# EAGLE design jelly_encoder_Board (EAGLE 8.7.1)
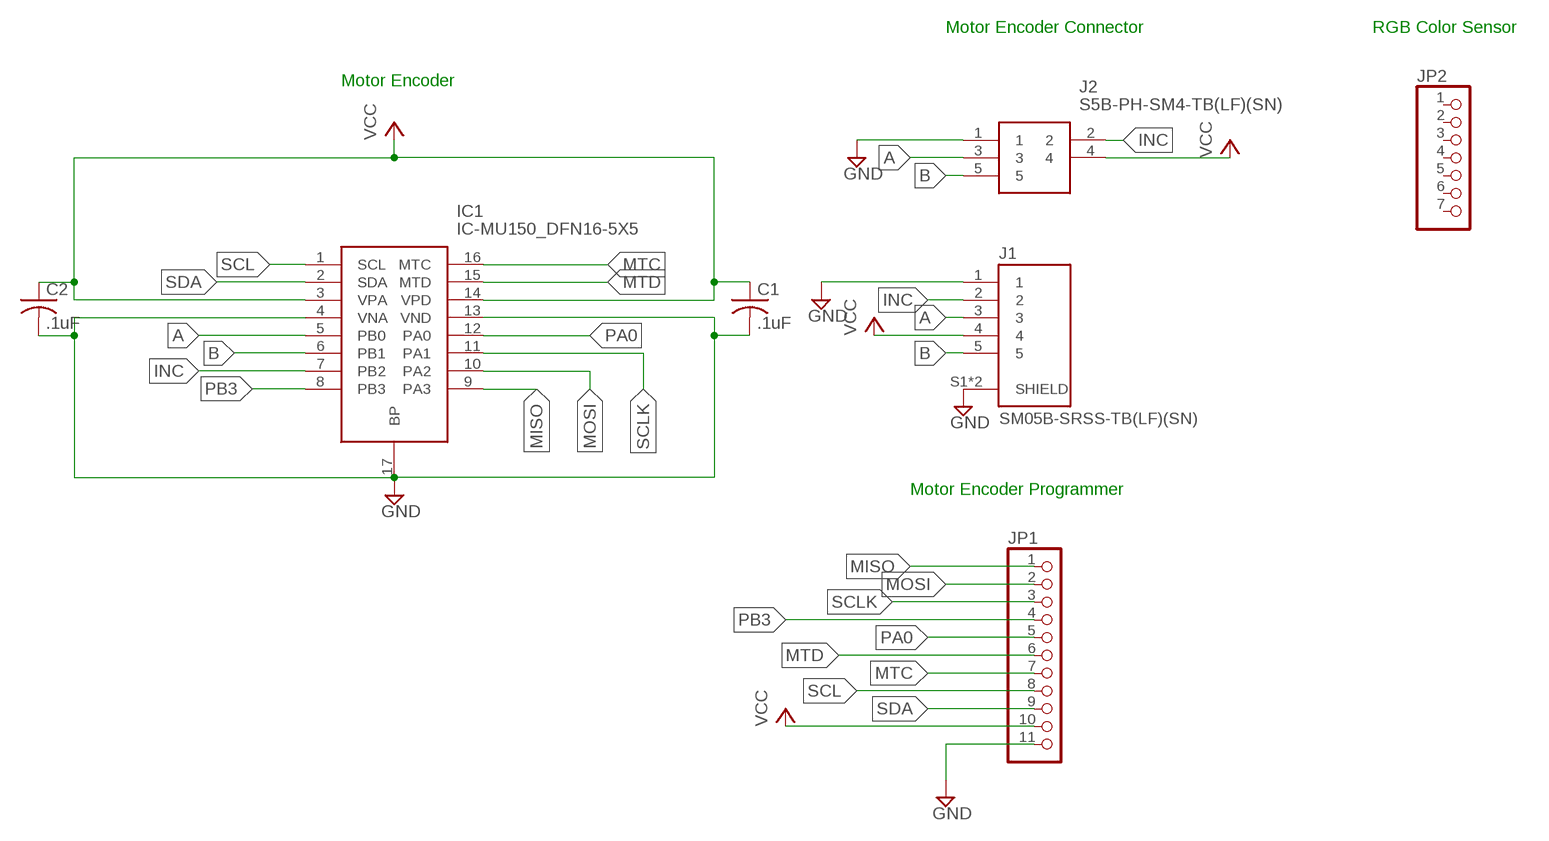
[diagram p0: schematic, sheet 1]

## Parts
C1  .1uF  C-USC0603  [C0603]
C2  .1uF  C-USC0603  [C0603]
IC1  IC-MU150_DFN16-5X5  [SON50P500X500X100-17N]
J1  SM05B-SRSS-TB(LF)(SN)  [JST_SM05B-SRSS-TB(LF)(SN)]
J2  S5B-PH-SM4-TB(LF)(SN)  [S5B-PH-SM4-TB_1]
JP1  PINHD-1X11/90  [1X11/90]
JP2  PINHD-1X7/90  [1X07/90]

## Nets
A: IC1.5(PB0) J1.3 J2.3
B: IC1.6(PB1) J1.5 J2.5
GND: C1.2 C2.2 IC1.4(VNA) IC1.13(VND) IC1.17(BP) J1.1 J1.S1(SHIELD) J1.S2(SHIELD) J2.1 JP1.11
INC: IC1.7(PB2) J1.2 J2.2
MISO: IC1.9(PA3) JP1.1
MOSI: IC1.10(PA2) JP1.2
MTC: IC1.16(MTC) JP1.7
MTD: IC1.15(MTD) JP1.6
PA0: IC1.12(PA0) JP1.5
PB3: IC1.8(PB3) JP1.4
SCL: IC1.1(SCL) JP1.8
SCLK: IC1.11(PA1) JP1.3
SDA: IC1.2(SDA) JP1.9
VCC: C1.1 C2.1 IC1.3(VPA) IC1.14(VPD) J1.4 J2.4 JP1.10
Unconnected: JP2.1 JP2.2 JP2.3 JP2.4 JP2.5 JP2.6 JP2.7

## Notes on the sheet
- Motor Encoder Connector | RGB Color Sensor
- Motor Encoder
- Motor Encoder Programmer

## Library data of the parts
C1 C2 = resistor:C-US: CAPACITOR, American symbol
IC1 = IC-MU150_DFN16-5X5:IC-MU150_DFN16-5X5: iC-MU150 MAGNETIC OFF-AXIS POSITION ENCODER - POLE WIDTH 1.50MM Source: Datasheet <http://www.ichaus.de/upload/pdf/MU150_datasheet_C1en.pdf>; DESCRIPTION: iC-MU150 MAGNETIC OFF-AXIS POSITION ENCODER - POLE WIDTH 1.50MM; HEIGHT: 1mm; MANUFACTURER_NAME: ic-haus; MANUFACTURER_PART_NUMBER: IC-MU150 DFN16-5X5
J1 = SM05B-SRSS-TB_LF__SN_:SM05B-SRSS-TB(LF)(SN): SH Series 5 Position 1 mm Pitch Surface Mount Side Entry Shrouded Header; AVAILABILITY: Unavailable; DESCRIPTION: SH Series 5 Position 1 mm Pitch Surface Mount Side Entry Shrouded Header; MF: JST Sales; MP: SM05B-SRSS-TB_LF__SN_; PACKAGE: None; PRICE: None
J2 = S5B-PH-SM4-TB(LF)(SN):S5B-PH-SM4-TB(LF)(SN): JST PH Series, 2mm Pitch 5 Way 1 Row Right Angle PCB Header, Solder Termination, 2A Source: Datasheet <http://www.jst-mfg.com/product/pdf/eng/ePH.pdf>; DESCRIPTION: JST PH Series, 2mm Pitch 5 Way 1 Row Right Angle PCB Header, Solder Termination, 2A; HEIGHT: mm; MANUFACTURER_NAME: JST (JAPAN SOLDERLESS TERMINALS); MANUFACTURER_PART_NUMBER: S5B-PH-SM4-TB(LF)(SN)
JP1 = pinhead:PINHD-1X11: PIN HEADER
JP2 = pinhead:PINHD-1X7: PIN HEADER

## Net classes
0 default: width 0.254 mm, drill 0.051 mm

## Board
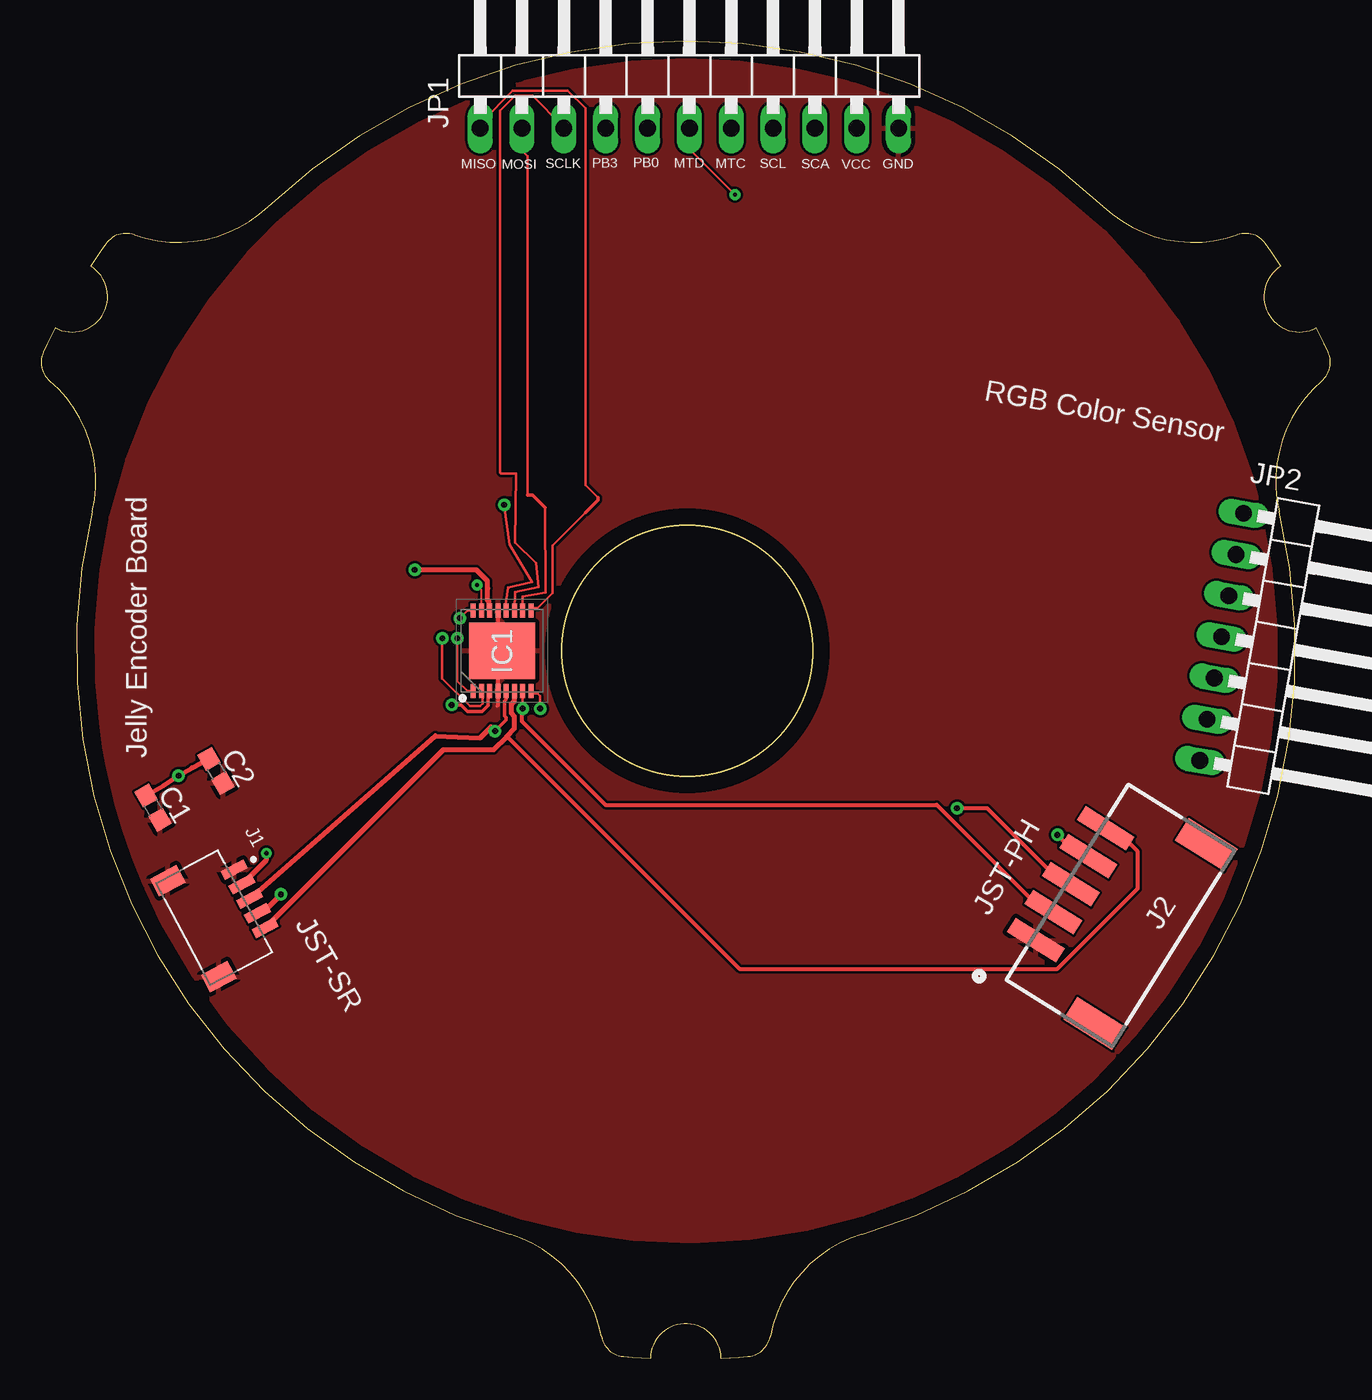
[diagram p1: board, top side]
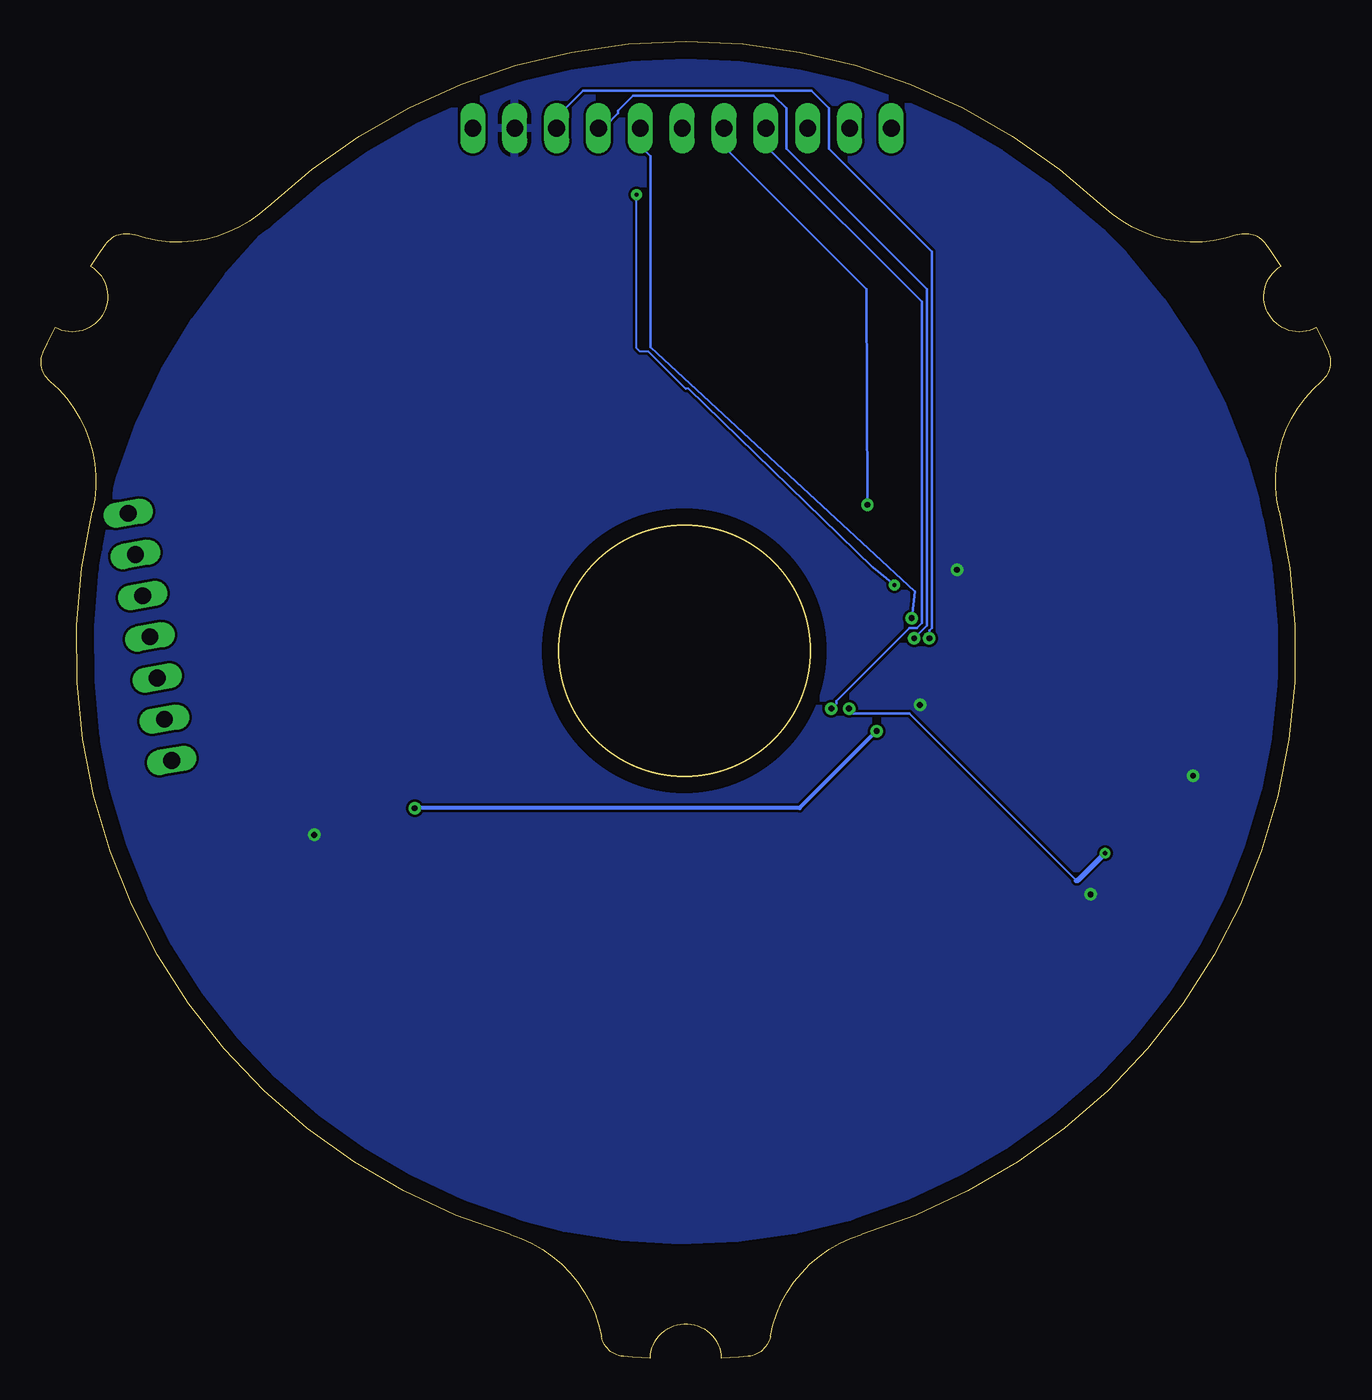
[diagram p2: board, bottom side, seen from below]

Size 78.25 x 79.95 mm. Coordinates in mm from the lower left corner, seen from the top.
Outline: 49.81,7.52 arc86 75.15,51.41 arc-63 77.73,59.31 arc74 78.11,61.09 arc2 77.39,62.56 arc-177 75.24,66.28 arc2 74.33,67.64 arc74 72.6,68.19 arc-63 64.46,69.91 arc86 13.79,69.91 arc-63 5.65,68.19 arc74 3.92,67.64 arc2 3.01,66.28 arc-177 0.86,62.56 arc2 0.14,61.09 arc74 0.52,59.31 arc-63 3.11,51.41 arc86 28.44,7.52 arc-63 34,1.33 arc74 35.34,0.11 arc2 36.98,0 arc-177 41.28,0 arc2 42.91,0.11 arc74 44.25,1.33 arc-63 49.81,7.52
Outline: circle at 39.21,42.95 radius 7.62
Copper layers (1*16): Top 0.035mm / dielectric 1.5mm / Bottom 0.035mm
Design rules "default": minimum track width 6mil, minimum drill 0.35mm, track to track 6mil, track to pad 6mil, pad to pad 6mil, via to via 6mil, smd to smd 6mil, copper to edge 40mil, drill to drill 6mil, minimum pad ring 10mil, minimum via ring 8mil, stop-mask expansion 4mil, vias tented up to drill 0mil, thermal gap 10mil

### Footprints (pad centres in the part's own frame; a part is rotated, then mirrored left to right if it is on the bottom)
C0603 = smd 1.1 x 1: 1 -0.85,0; 2 0.85,0
SON50P500X500X100-17N = smd 0.85 x 0.3: 1 -2.45,1.75; 2 -2.45,1.25; 3 -2.45,0.75; 4 -2.45,0.25; 5 -2.45,-0.25; 6 -2.45,-0.75; 7 -2.45,-1.25; 8 -2.45,-1.75; 9 2.45,-1.75; 10 2.45,-1.25; 11 2.45,-0.75; 12 2.45,-0.25; 13 2.45,0.25; 14 2.45,0.75; 15 2.45,1.25; 16 2.45,1.75 | smd 3.45 x 4: 17 0,0
JST_SM05B-SRSS-TB(LF)(SN) = smd 0.6 x 1.55: 1 -2,3.875; 2 -1,3.875; 3 0,3.875; 4 1,3.875; 5 2,3.875 | smd 1.2 x 1.8: S1 -3.3,0; S2 3.3,0
S5B-PH-SM4-TB_1 = smd 1 x 3.5: 1 8,0; 2 6,0; 3 4,0; 4 2,0; 5 0,0 | smd 1.6 x 3.5: 6 -2.4,5.7; 7 10.4,5.7
1X11/90 = drill 1.016 long: 1 -12.7,-3.81; 2 -10.16,-3.81; 3 -7.62,-3.81; 4 -5.08,-3.81; 5 -2.54,-3.81; 6 0,-3.81; 7 2.54,-3.81; 8 5.08,-3.81; 9 7.62,-3.81; 10 10.16,-3.81; 11 12.7,-3.81
1X07/90 = drill 1.016 long: 1 -7.62,-3.81; 2 -5.08,-3.81; 3 -2.54,-3.81; 4 0,-3.81; 5 2.54,-3.81; 6 5.08,-3.81; 7 7.62,-3.81

### Placement (x,y rotation side)
C1  6.79,33.42 300 top
C2  10.61,35.65 300 top
IC1  27.98,42.95 90 top
J1  9.23,26.07 298 top
J2  64.62,32.16 238 top
JP1  39.35,78.47 0 top
JP2  75.4,43.13 260 top

### Tracks (layer width: path | path; a pad name or v marks a point on that pad's centre or on a via)
A  (via drill 0.35)
  Top 0.203: v27.54,38.07 28.23,38.75 28.23,38.9 28.13,38.99 28.13,39.89 28.23,39.99 IC1.5
  Top 0.254: v55.59,33.4 57.41,33.4 61.88,28.93 62.49,28.93 J2.3
  Top 0.305: J1.3 23.91,37.79 26.63,37.66 27.29,38.32 v27.54,38.07
  Bottom 0.254: v55.59,33.4 32.22,33.4 v27.54,38.07
B
  Top 0.254: J2.5 64.73,31.97 65.34,31.97 66.56,30.75 66.56,28.52 61.68,23.64 42.38,23.64 28.36,37.66 28.27,37.75
  Top 0.305: J1.5 24.42,36.95 27.46,36.95 28.27,37.75 28.73,38.22 28.73,38.97 28.54,39.16 28.54,39.72 28.73,39.91 IC1.6
GND
  Top 0.203: 27.69,39.58 27.73,39.63 IC1.4 27.73,41.75 | IC1.13 27.73,44.31 27.81,44.23
  pour Top (isolate 0): 64.53,68.35 arc197 22.62,11.2 arc163
INC  (via drill 0.25, 0.35)
  Top 0.152: v29.22,39.44 29.22,40.36 IC1.7
  Top 0.254: J2.2 61.28,27.1 60.87,27.1 54.37,33.6 34.25,33.6 29.17,38.68 29.17,39.29 v29.22,39.44
  Top 0.305: J1.2 13.67,30.26 v13.67,30.66
  Bottom 0.152: 28.92,39.14 25.56,39.14 15.43,29 | 28.92,39.14 29.07,39.14 | 28.92,39.14 v29.22,39.44
  Bottom 0.305: v13.67,30.66 15.33,29 15.43,29
MISO
  Top 0.152: 33.03,51.33 31.05,49.35 31.05,46.45 30.13,45.54 29.83,45.54 IC1.9 | 33.79,52.24 33.03,53 33.03,75.86 31.96,76.93 28.61,76.93 26.78,75.1 26.78,74.8 JP1.1
  Top 0.203: 33.03,51.33 33.79,52.09 33.79,52.24
MOSI
  Top 0.152: 30.58,51.65 30.61,46.47 29.21,46.24 29.21,45.98 IC1.10 | 29.53,52.4 29.53,72.97 29.22,73.27 29.22,74.65 JP1.2
  Top 0.203: 29.53,52.4 29.83,52.4 30.58,51.65
MTC  (via drill 0.35)
  Top 0.152: v25.41,44.93 25.87,45.38 26.17,45.38 IC1.16
  Bottom 0.152: v25.41,44.93 25.21,46.55 41.26,61.39 41.26,72.97 41.87,73.58 41.87,74.65 JP1.7
MTD  (via drill 0.25)
  Top 0.127: 26.76,45.77 26.73,45.74 IC1.15 26.73,46.62 v26.46,46.93 | v42.12,70.63 39.35,73.4 JP1.6
  Bottom 0.127: v26.46,46.93 27.76,48 38.95,58.85 39.13,58.85 41.4,61.11 41.92,61.11 42.12,61.31 v42.12,70.63
PA0  (via drill 0.35)
  Top 0.152: v28.1,51.8 28.42,49.39 29.81,47.1 28.35,46.79 28.15,45.54 IC1.12
  Bottom 0.152: v28.1,51.8 28.15,64.89 36.69,73.43 36.69,74.65 JP1.5
PB3  (via drill 0.35)
  Top 0.152: v30.29,39.44 30.29,40.2 30.13,40.36 29.83,40.36 IC1.8
  Bottom 0.152: v30.29,39.44 29.98,39.75 29.98,39.9 25.56,44.32 25.11,44.32 24.8,44.62 24.8,64.13 34.25,73.58 34.25,74.65 JP1.4
SCL  (via drill 0.35)
  Top 0.152: v25.26,43.71 25.26,41.12 25.87,40.51 26.17,40.51 IC1.1
  Bottom 0.152: v25.26,43.71 24.5,44.47 24.5,64.89 33.03,73.43 33.03,75.86 33.79,76.63 42.33,76.63 43.24,75.71 43.24,75.56 44,74.8 44.31,74.8 JP1.8
SCLK
  Top 0.152: IC1.11 28.77,46.5 30.2,46.81 30.03,48.28 28.76,49.5 28.83,53.7 27.91,53.7 27.85,53.77 27.85,75.71 28.76,76.63 29.83,76.63 31.66,74.8 JP1.3
SDA  (via drill 0.35)
  Top 0.152: v24.34,43.71 24.34,41.27 26.02,39.59 26.63,39.59 26.78,39.75 26.78,40.36 IC1.2
  Bottom 0.152: v24.34,43.71 24.34,44.17 24.19,44.32 24.19,67.18 30.44,73.43 30.44,75.86 31.51,76.93 45.37,76.93 46.9,75.41 46.9,74.8 JP1.9
VCC  (via drill 0.35)
  Top 0.203: v24.91,39.66 25.48,39.66 25.88,39.26 26.77,39.26 27.14,39.64 27.14,40.41 IC1.3
  Top 0.254: v61.68,31.77 62.9,30.55 63.51,30.55 J2.4
  Top 0.305: C1.1 7.43,34.77 v8.34,35.36 9.15,35.84 C2.1 | J1.4 13.41,27.01 v14.55,28.16 | IC1.14 27.18,45.44 27.18,45.95 27.09,46.03 27.09,46.61 27.1,46.75 27.09,46.76 27.09,47.19 26.42,47.86 v22.67,47.86
  pour Bottom (isolate 0): 64.53,68.35 arc197 22.62,11.2 arc163

### Text on the board
tPlace: MISO | MOSI | SCLK | PB3 | PB0 | MTD | MTC | SCL | SCA | VCC | GND | RGB Color Sensor | Jelly Encoder Board | JST-PH | JST-SR